# Altium schematic sheet bmsMaster_main.SchDoc
size B; SheetNumber: 1; SheetTotal: 7
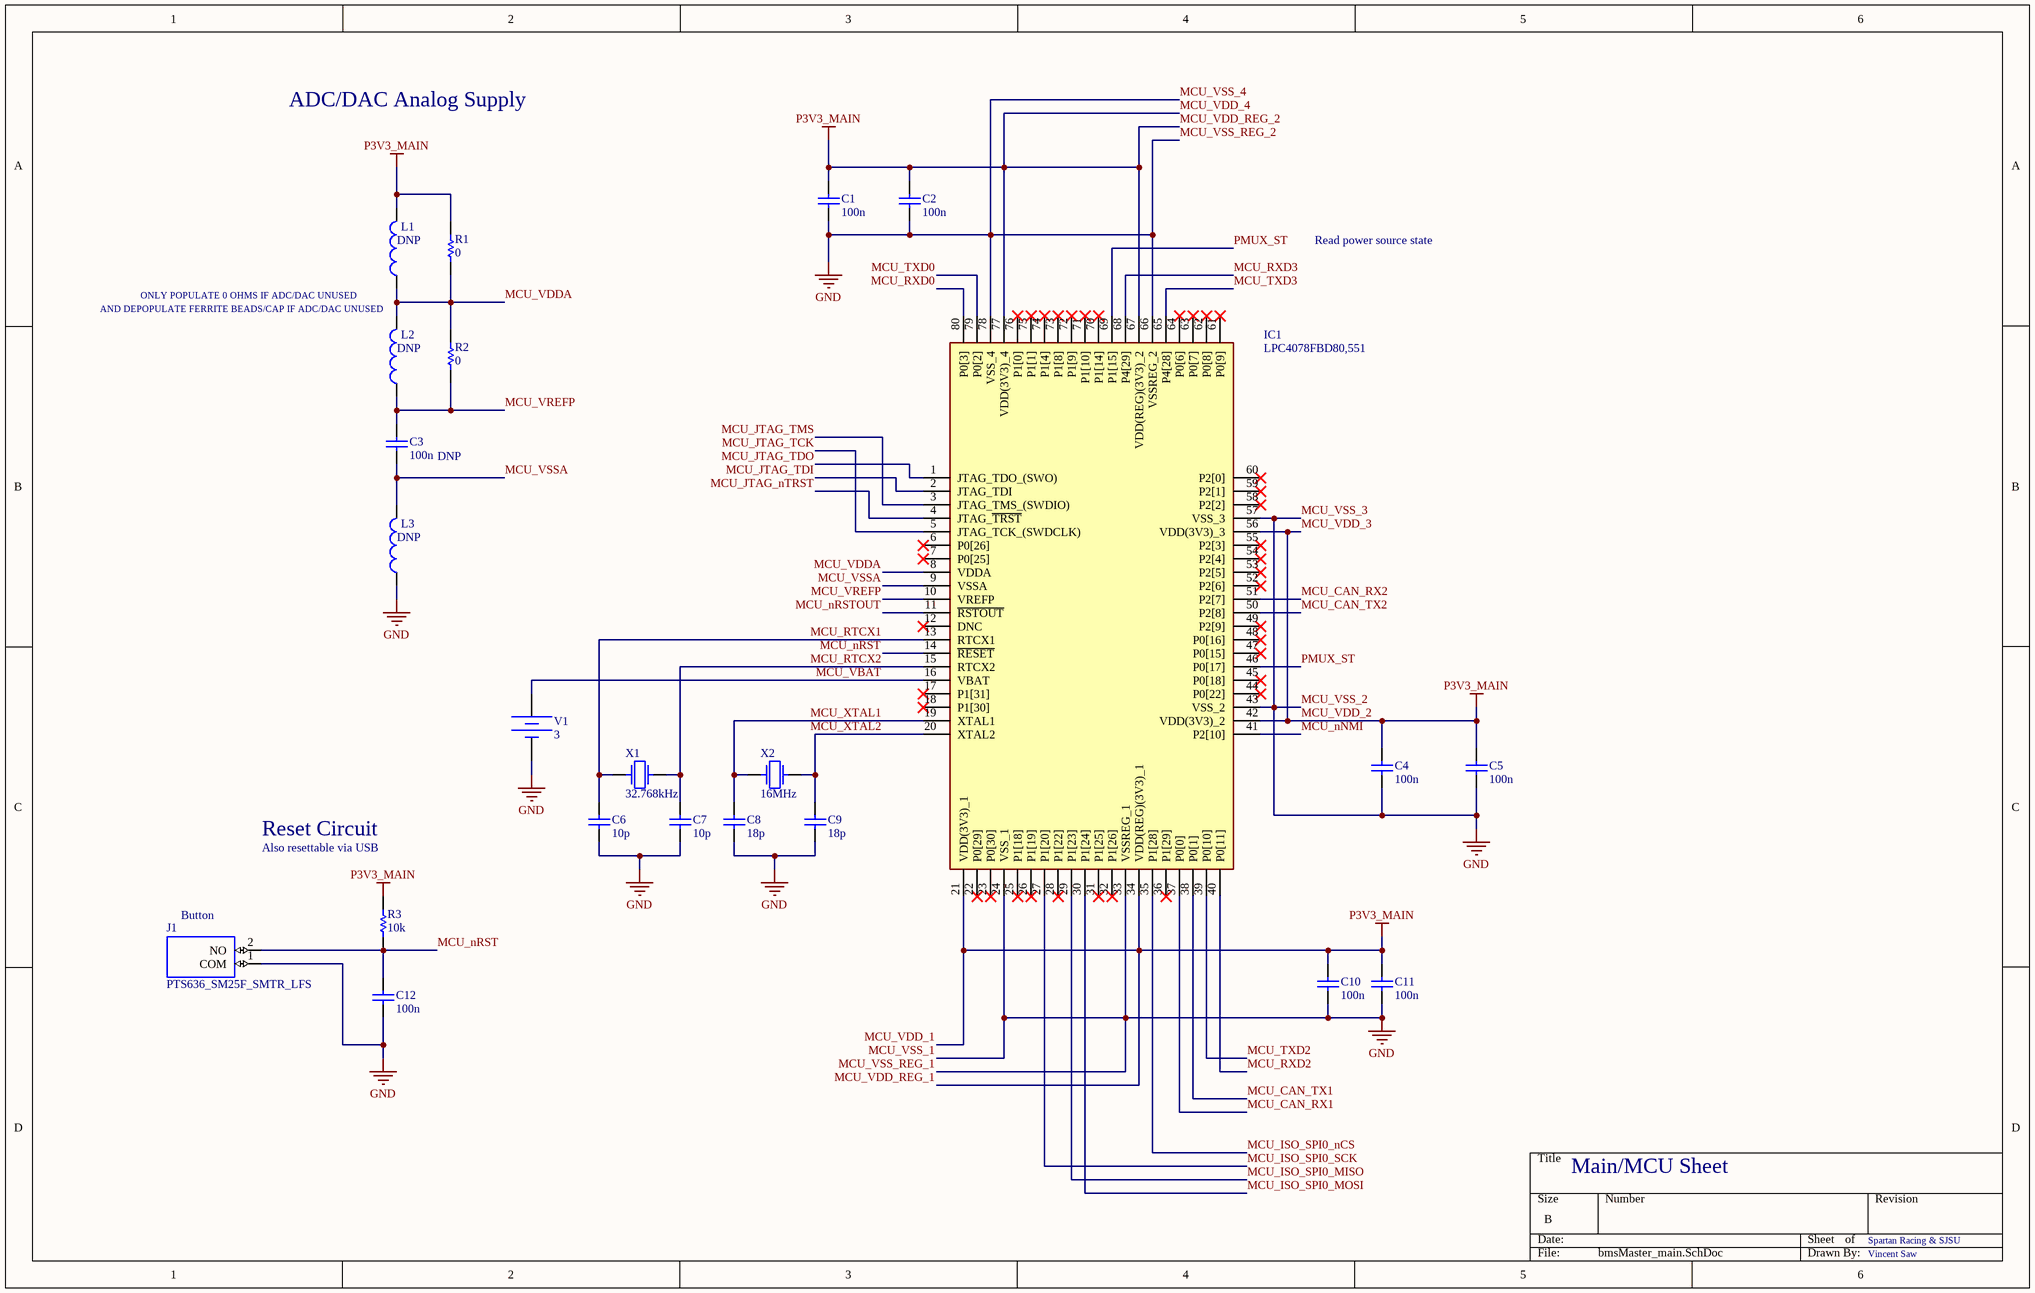
[diagram p0: bmsMaster_main.SchDoc]

## Parts
C1  value 100n  (hidden comment: Capacitor)
C2  value 100n  (hidden comment: Capacitor)
C3  value 100n  (hidden comment: Capacitor)
C4  value 100n  (hidden comment: Capacitor)
C5  value 100n  (hidden comment: Capacitor)
C6  value 10p  (hidden comment: Capacitor)
C7  value 10p  (hidden comment: Capacitor)
C8  value 18p  (hidden comment: Capacitor)
C9  value 18p  (hidden comment: Capacitor)
C10  value 100n  (hidden comment: Capacitor)
C11  value 100n  (hidden comment: Capacitor)
C12  value 100n  (hidden comment: Capacitor)
IC1  LPC4078FBD80,551  [QFP50P1400X1400X160-80N]
J1  PTS636_SM25F_SMTR_LFS  [PTS636SM25FSMTRLFS]
L1  Inductor  (value not drawn)
L2  Inductor  (value not drawn)
L3  Inductor  (value not drawn)
R1  value 0  (hidden comment: Resistor)
R2  value 0  (hidden comment: Resistor)
R3  value 10k  (hidden comment: Resistor)
V1  DC Magnitude: 3  (hidden comment: Constant Voltage Source)
X1  F0: 32.768kHz  (hidden comment: Crystal)
X2  F0: 16MHz  (hidden comment: Crystal)

## Nets
MCU_VDD_1: C1.2 C2.2 C4.2 C5.2 C10.2 C11.2 IC1.21(VDD(3V3)_1) IC1.34(VDD(REG)(3V3)_1) IC1.42(VDD(3V3)_2) IC1.56(VDD(3V3)_3) IC1.67(VDD(REG)(3V3)_2) IC1.77(VDD(3V3)_4) L1.2 R1.2 R3.2  [also labelled MCU_VDD_2, MCU_VDD_3, MCU_VDD_4, MCU_VDD_REG_1, MCU_VDD_REG_2, P3V3_MAIN]
MCU_VSS_1: C1.1 C2.1 C4.1 C5.1 C6.1 C7.1 C8.1 C9.1 C10.1 C11.1 C12.1 IC1.24(VSS_1) IC1.33(VSSREG_1) IC1.43(VSS_2) IC1.57(VSS_3) IC1.66(VSSREG_2) IC1.78(VSS_4) J1.1(COM) L3.1 V1.2  [also labelled GND, MCU_VSS_2, MCU_VSS_3, MCU_VSS_4, MCU_VSS_REG_1, MCU_VSS_REG_2]
MCU_CAN_RX1: IC1.37(P0[0])
MCU_CAN_RX2: IC1.51(P2[7])
MCU_CAN_TX1: IC1.38(P0[1])
MCU_CAN_TX2: IC1.50(P2[8])
MCU_ISO_SPI0_MISO: IC1.29(P1[23])
MCU_ISO_SPI0_MOSI: IC1.30(P1[24])
MCU_ISO_SPI0_nCS: IC1.35(P1[28])
MCU_ISO_SPI0_SCK: IC1.27(P1[20])
MCU_JTAG_nTRST: IC1.4(JTAG_~{TRST})
MCU_JTAG_TCK: IC1.5(JTAG_TCK_(SWDCLK))
MCU_JTAG_TDI: IC1.2(JTAG_TDI)
MCU_JTAG_TDO: IC1.1(JTAG_TDO_(SWO))
MCU_JTAG_TMS: IC1.3(JTAG_TMS_(SWDIO))
MCU_nNMI: IC1.41(P2[10])
MCU_nRST: C12.2 IC1.14(~{RESET}) J1.2(NO) R3.1
MCU_nRSTOUT: IC1.11(~{RSTOUT})
MCU_RTCX1: C6.2 IC1.13(RTCX1) X1.1
MCU_RTCX2: C7.2 IC1.15(RTCX2) X1.2
MCU_RXD0: IC1.80(P0[3])
MCU_RXD2: IC1.40(P0[11])
MCU_RXD3: IC1.68(P4[29])
MCU_TXD0: IC1.79(P0[2])
MCU_TXD2: IC1.39(P0[10])
MCU_TXD3: IC1.65(P4[28])
MCU_VBAT: IC1.16(VBAT) V1.1
MCU_VDDA: IC1.8(VDDA) L1.1 L2.2 R1.1 R2.2
MCU_VREFP: C3.2 IC1.10(VREFP) L2.1 R2.1
MCU_VSSA: C3.1 IC1.9(VSSA) L3.2
MCU_XTAL1: C8.2 IC1.19(XTAL1) X2.1
MCU_XTAL2: C9.2 IC1.20(XTAL2) X2.2
PMUX_ST: IC1.46(P0[17]) IC1.69(P1[15])

Not connected (* = marked no-connect by the designer): IC1 6(P0[26])* 7(P0[25])* 12(DNC)* 17(P1[31])* 18(P1[30])* 22(P0[29])* 23(P0[30])* 25(P1[18])* 26(P1[19])* 28(P1[22])* 31(P1[25])* 32(P1[26])* 36(P1[29])* 44(P0[22])* 45(P0[18])* 47(P0[15])* 48(P0[16])* 49(P2[9])* 52(P2[6])* 53(P2[5])* 54(P2[4])* 55(P2[3])* 58(P2[2])* 59(P2[1])* 60(P2[0])* 61(P0[9])* 62(P0[8])* 63(P0[7])* 64(P0[6])* 70(P1[14])* 71(P1[10])* 72(P1[9])* 73(P1[8])* 74(P1[4])* 75(P1[1])* 76(P1[0])*

## Notes on the sheet
- ADC/DAC Analog Supply
- ONLY POPULATE 0 OHMS IF ADC/DAC UNUSED
- (near L1) DNP
- Read power source state
- AND DEPOPULATE FERRITE BEADS/CAP IF ADC/DAC UNUSED
- (near L2) DNP
- (near C3) DNP
- (near L3) DNP
- Reset Circuit
- Also resettable via USB
- (near J1) Button
- Main/MCU Sheet
- Spartan Racing & SJSU
- Vincent Saw

## Library data of the parts
C1-C12 = Capacitor: SimulationGenericComponent: True
IC1 = LPC4078FBD80,551: Integrated Circuit; Manufacturer_Name: NXP; Datasheet Link: http://www.nxp.com/docs/en/data-sheet/LPC408X_7X.pdf; Height: 1.6mm; Manufacturer_Part_Number: LPC4078FBD80,551; Mouser Part Number: 771-LPC4078FBD80551; Mouser Price/Stock: https://www.mouser.co.uk/ProductDetail/NXP-Semiconductors/LPC4078FBD80551?qs=vnbNJPHmPnPMtBCcoSguaA%3D%3D; Arrow Part Number: LPC4078FBD80,551; Arrow Price/Stock: https://www.arrow.com/en/products/lpc4078fbd80551/nxp-semiconductors
J1 = PTS636_SM25F_SMTR_LFS: Tactile Switch SPST-NO Top Actuated Surface Mount; MF: C&K; MP: PTS636 SM25F SMTR LFS; SnapEDA_Link: https://www.snapeda.com/parts/PTS636%20SM25F%20SMTR%20LFS/C%2526K/view-part/?ref=snap; Check_prices: https://www.snapeda.com/parts/PTS636%20SM25F%20SMTR%20LFS/C%2526K/view-part/?ref=eda; Value: *; Purchase-URL: https://pricing.snapeda.com/search/part/PTS636 SM25F SMTR LFS/?ref=eda; Availability: In Stock; Price: None; Package: None
L1-L3 = Inductor: SimulationGenericComponent: True
R1 R2 = Resistor: SimulationGenericComponent: True; TC1: 0; TC2: 0
R3 = Resistor: TC1: 0; SimulationGenericComponent: True; TC2: 0
V1 = Battery: SimulationGenericComponent: True
X1 X2 = Crystal: R: 500; Q: 50K; SimulationGenericComponent: True